# EasyEDA Pro project ProPrj_通用工程PCB-Update-V3.1_2025-07-16.epro, schematic [SCH]Advance_Board

## Sheets
1 P1: Board Name: Advance_Board; Create Date: 2025-07-09; Page Name: P1; Project Name: 通用工程PCB-Update-V3.1; Schematic Name: [SCH]Advance_Board; Update Date: 2025-07-09; Company: 嘉立创EDA; Page Size: A3; Version: V1.0
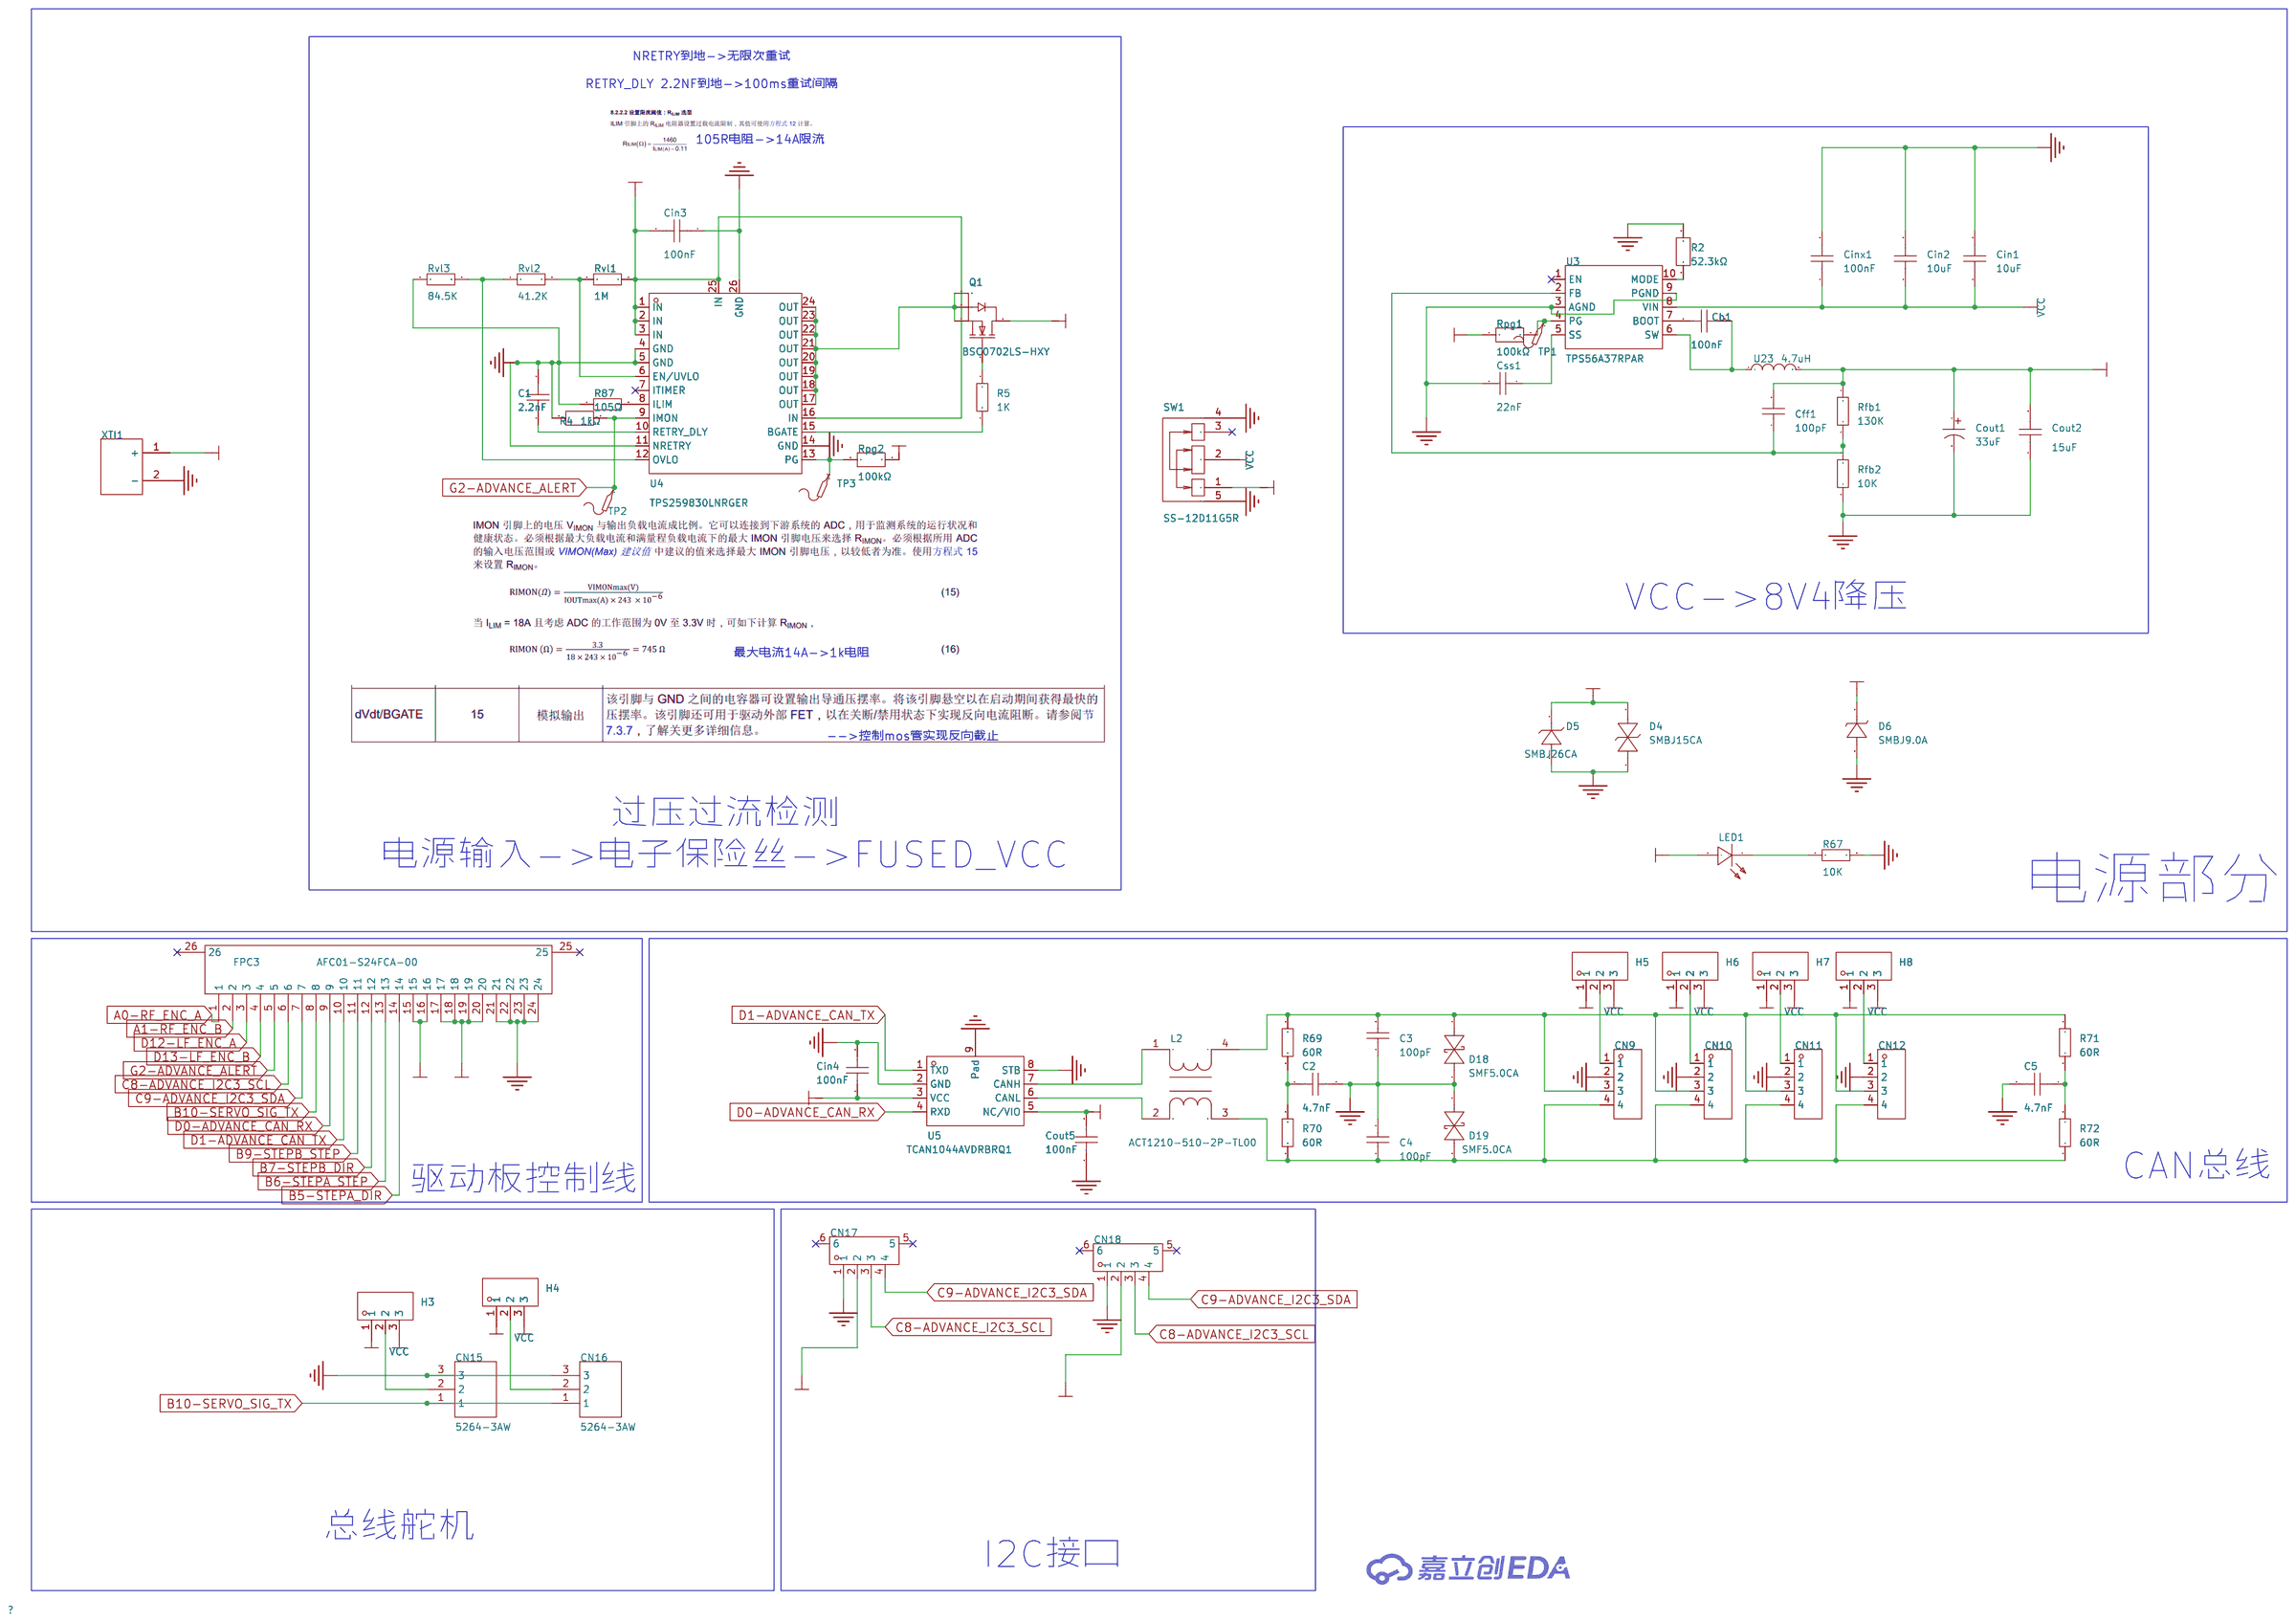
[diagram p2: P1]
2 P2: Page Name: P2
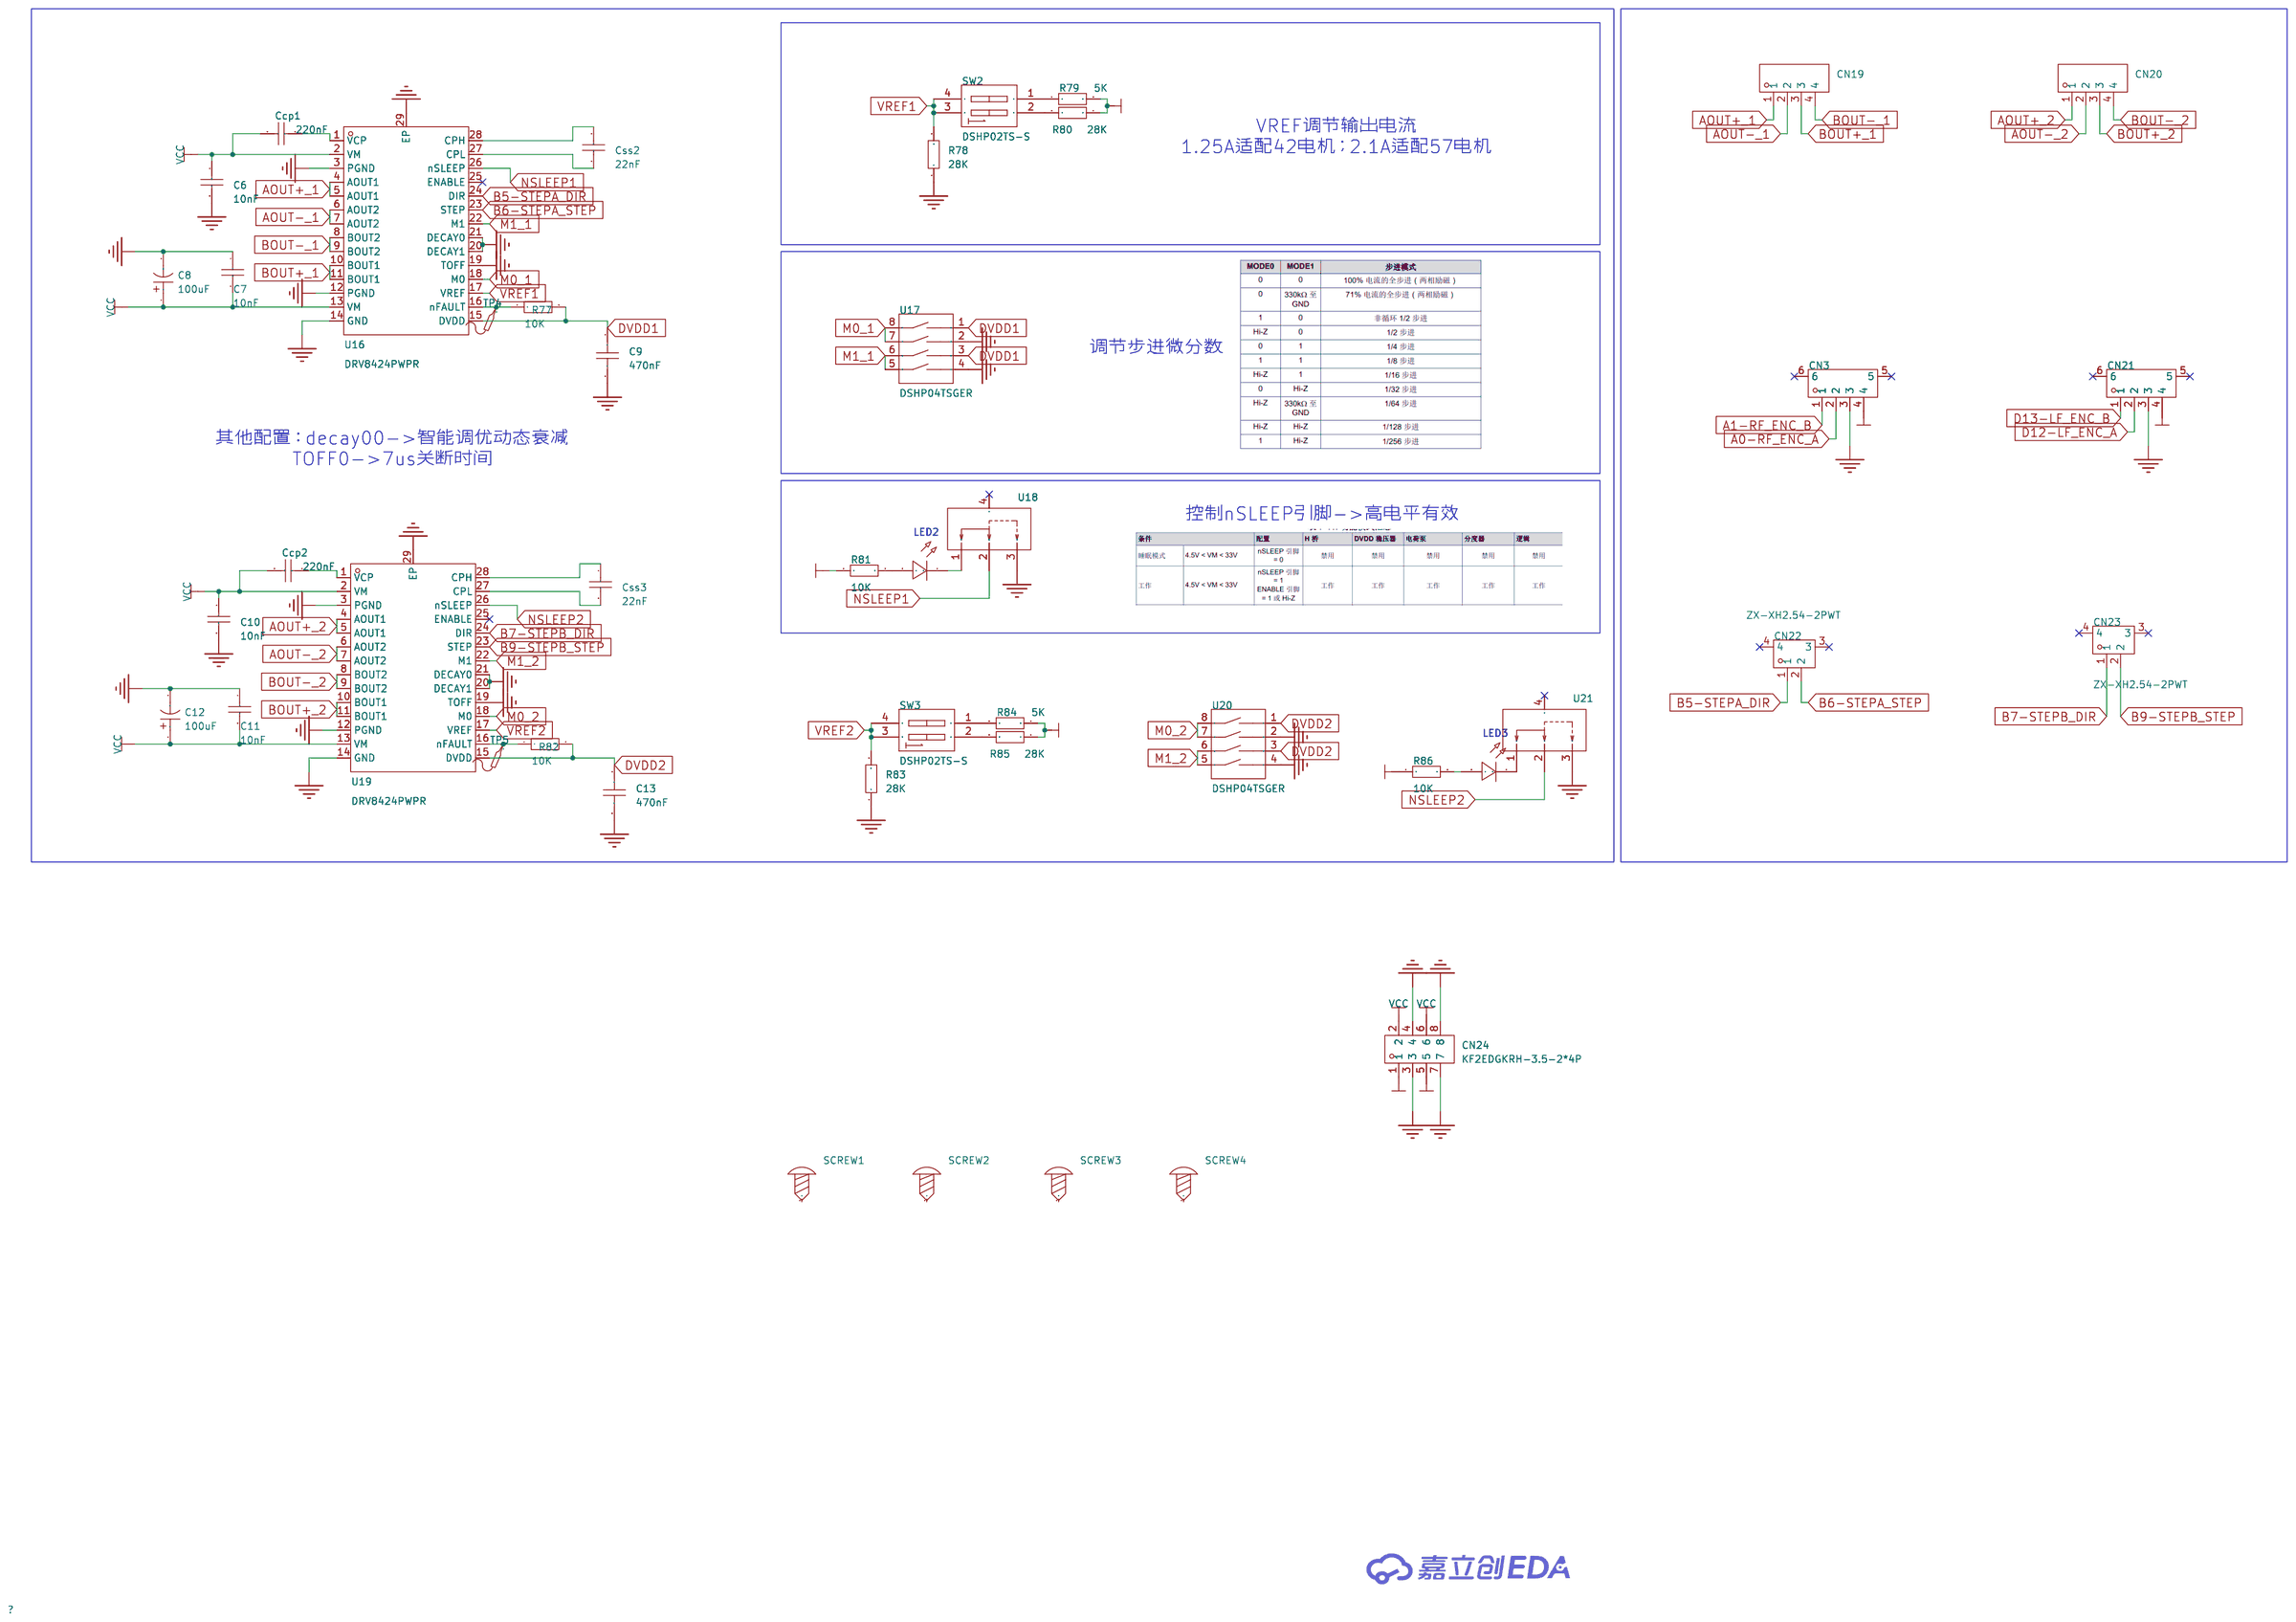
[diagram p3: P2]

## Parts
sheet P1
C1  2.2nF  [C0402]
C2  4.7nF  [C0402]
C3  100pF  [C0402]
C4  100pF  [C0402]
C5  4.7nF  [C0402]
Cb1  100nF  [C0603]
Cff1  100pF  [C0603]
Cin1  10uF  [C1210]
Cin2  10uF  [C1210]
Cin3  100nF  [C0603]
Cin4  100nF  [C0603]
Cinx1  100nF  [C0805]
CN9  KF2EDGR-3.5-4P  [CONN-TH_4P-P3.50_KF2EDGR-3.5-4P]
CN10  KF2EDGR-3.5-4P  [CONN-TH_4P-P3.50_KF2EDGR-3.5-4P]
CN11  KF2EDGR-3.5-4P  [CONN-TH_4P-P3.50_KF2EDGR-3.5-4P]
CN12  KF2EDGR-3.5-4P  [CONN-TH_4P-P3.50_KF2EDGR-3.5-4P]
CN15  5264-3AW  [CONN-TH_5264-3AW]
CN16  5264-3AW  [CONN-TH_5264-3AW]
CN17  XDWF-2500-04P  [CONN-SMD_4P-P2.54_MXXH-2.54-04P-WT1-0-A]
CN18  XDWF-2500-04P  [CONN-SMD_4P-P2.54_MXXH-2.54-04P-WT1-0-A]
Cout1  33uF  [CAP-SMD_BD5.0-L5.3-W5.3-LS6.3-FD]
Cout2  15uF  [C1812]
Cout5  100nF  [C0603]
Css1  22nF  [C0402]
D4  SMBJ15CA  [SMB_L4.6-W3.6-LS5.4-BI]
D5  SMBJ26CA  [SMB_L4.6-W3.6-LS5.4-RD]
D6  SMBJ9.0A  [SMB_L4.6-W3.6-LS5.3-RD]
D18  SMF5.0CA  [SOD-123FL_L2.7-W1.8-LS3.8-BI]
D19  SMF5.0CA  [SOD-123FL_L2.7-W1.8-LS3.8-BI]
FPC3  AFC01-S24FCA-00  [FPC-SMD_24P-P0.50_AFC01-S24FCA-00]
H3  -  [HDR-TH_3P-P2.54-V-M]
H4  -  [HDR-TH_3P-P2.54-V-M]
H5  -  [HDR-TH_3P-P2.54-V-M]
H6  -  [HDR-TH_3P-P2.54-V-M]
H7  -  [HDR-TH_3P-P2.54-V-M]
H8  -  [HDR-TH_3P-P2.54-V-M]
L2  ACT1210-510-2P-TL00  [FILTER-SMD_4P-L3.2-W2.5-BL_ACT1210]
LED1  LTST-C191KSKT  [LED0603-RD-YELLOW]
Q1  BSC0702LS-HXY  [TDSON-8_L5.9-W5.2-P1.27-BL]
R2  52.3kΩ  [R0402]
R4  1kΩ  [R0402]
R5  1K  [R0402]
R67  10K  [R0603]
R69  60R  [R0603]
R70  60R  [R0603]
R71  60R  [R0603]
R72  60R  [R0603]
R87  105Ω  [R0402]
Rfb1  130K  [R0805]
Rfb2  10K  [R0805]
Rpg1  100kΩ  [R0402]
Rpg2  100kΩ  [R0402]
Rvl1  1M  [R0805]
Rvl2  41.2K  [R0805]
Rvl3  84.5K  [R0805]
SW1  SS-12D11G5R  [SW-TH_SS-12D11G5R]
TP1  -  [Test-Point-0.5mm]
TP2  -  [Test-Point-0.5mm]
TP3  -  [Test-Point-0.5mm]
U3  TPS56A37RPAR  [VQFN-HR-10_L3.0-W3.0_TI_RPA]
U4  TPS259830LNRGER  [VQFN-24_L4.0-W4.0-P0.50-TL-EP_TI_RGE]
U5  TCAN1044AVDRBRQ1  [TDFN-8_L3.0-W3.0-P0.65-BL-EP]
U23  4.7uH  [IND-SMD_L7.0-W6.6_APH0630]
XTI1  -  [XT60PW]
sheet P2
C6  10nF  [C0402]
C7  10nF  [C0402]
C8  100uF  [CAP-SMD_BD6.3-L6.6-W6.6-FD-1]
C9  470nF  [C0402]
C10  10nF  [C0402]
C11  10nF  [C0402]
C12  100uF  [CAP-SMD_BD6.3-L6.6-W6.6-FD-1]
C13  470nF  [C0402]
Ccp1  220nF  [C0402]
Ccp2  220nF  [C0402]
CN3  XDWF-2500-04P  [CONN-SMD_4P-P2.54_MXXH-2.54-04P-WT1-0-A]
CN19  KF2EDGR-3.5-4P  [CONN-TH_4P-P3.50_KF2EDGR-3.5-4P]
CN20  KF2EDGR-3.5-4P  [CONN-TH_4P-P3.50_KF2EDGR-3.5-4P]
CN21  XDWF-2500-04P  [CONN-SMD_4P-P2.54_MXXH-2.54-04P-WT1-0-A]
CN22  ZX-XH2.54-2PWT  [CONN-SMD_2P-P2.54_MEGASTAR_ZX-XH2.54-2PWT]
CN23  ZX-XH2.54-2PWT  [CONN-SMD_2P-P2.54_MEGASTAR_ZX-XH2.54-2PWT]
CN24  KF2EDGKRH-3.5-2*4P  [CONN-TH_8P-P3.50_KEFA_KF2EDGKRH-3.5-2-4P]
Css2  22nF  [C0402]
Css3  22nF  [C0402]
LED2  -  [LED_0402]
LED3  -  [LED_0402]
R77  10K  [R0402]
R78  28K  [R0402]
R79  5K  [R0402]
R80  28K  [R0402]
R81  10K  [R0402]
R82  10K  [R0402]
R83  28K  [R0402]
R84  5K  [R0402]
R85  28K  [R0402]
R86  10K  [R0402]
SCREW1  -  [M3螺丝]
SCREW2  -  [M3螺丝]
SCREW3  -  [M3螺丝]
SCREW4  -  [M3螺丝]
SW2  DSHP02TS-S  [SW-SMD_DSHP02TS-S]
SW3  DSHP02TS-S  [SW-SMD_DSHP02TS-S]
TP4  -  [Test-Point-0.5mm]
TP5  -  [Test-Point-0.5mm]
U16  DRV8424PWPR  [HTSSOP-28_L9.7-W4.4-P0.65-LS6.4-BL-EP3.8]
U17  DSHP04TSGER  [SW-SMD_8P-L6.7-W5.4-P1.27-LS8.4]
U18  MSS12C02LS-BB2.0  [SW-SMD_MSS12C02LS-HB2.0-1]
U19  DRV8424PWPR  [HTSSOP-28_L9.7-W4.4-P0.65-LS6.4-BL-EP3.8]
U20  DSHP04TSGER  [SW-SMD_8P-L6.7-W5.4-P1.27-LS8.4]
U21  MSS12C02LS-BB2.0  [SW-SMD_MSS12C02LS-HB2.0-1]

## Library data of the parts
C1 = CC0402JRX7R9BB222: 容值:2.2nF;精度:±5%;额定电压:50V;材质(温度系数):X7R;; LCSC Part Name: 2.2nF ±5% 50V; Supplier Part: C513667; Manufacturer: YAGEO(国巨); Supplier Footprint: 0402; JLCPCB Part Class: 扩展库; Datasheet: https://atta.szlcsc.com/upload/public/pdf/source/20200415/C513667_43ACA5E3BCCDD816EC65E9B61132137F.pdf; Supplier: LCSC; Tolerance: ±5%; Voltage Rated: 50V; Temperature Coefficient: X7R
C2 C5 = GRM1555C1H472JE01D: 容值:4.7nF;精度:±5%;额定电压:50V;材质(温度系数):C0G;; LCSC Part Name: 4.7nF ±5% 50V; Supplier Part: C1518204; Manufacturer: muRata(村田); Supplier Footprint: 0402; JLCPCB Part Class: 扩展库; Datasheet: https://atta.szlcsc.com/upload/public/pdf/source/20211103/8141A083312BB8EB0F68297C590CBCF9.pdf; Supplier: LCSC; Tolerance: ±5%; Voltage Rated: 50V; Temperature Coefficient: C0G
C3 C4 = 0402CG101J500NT: 容值:100pF;精度:±5%;额定电压:50V;材质(温度系数):C0G;; LCSC Part Name: 100pF ±5% 50V; Supplier Part: C1546; Manufacturer: FH(风华); Supplier Footprint: 0402; JLCPCB Part Class: 基础库; Datasheet: https://atta.szlcsc.com/upload/public/pdf/source/20200305/C486355_26A10D38EF8C2A5C37091D0039909270.pdf; Supplier: LCSC; Tolerance: ±5%; Voltage Rated: 50V; Temperature Coefficient: C0G
Cb1 = CAP_0603: Supplier Footprint: 0603
Cff1 = CL10C101JB8NNNC: 容值:100pF;精度:±5%;额定电压:50V;材质(温度系数):C0G;; LCSC Part Name: 100pF ±5% 50V; Supplier Part: C14858; Manufacturer: SAMSUNG(三星); Supplier Footprint: 0603; JLCPCB Part Class: 基础库; Datasheet: https://atta.szlcsc.com/upload/public/pdf/source/20160218/1457707763339.pdf; Supplier: LCSC; Tolerance: ±5%; Voltage Rated: 50V; Temperature Coefficient: C0G
Cin1 Cin2 = GRM32EC72A106KE05L: 容值:10uF;精度:±10%;额定电压:100V;温度系数:X7S;; LCSC Part Name: 10uF ±10% 100V; Supplier Part: C576517; Manufacturer: muRata(村田); Supplier Footprint: 1210; Datasheet: https://atta.szlcsc.com/upload/public/pdf/source/20200716/C162505_CE68ED646330179BB59D1BEC6A5D09D7.pdf; Supplier: LCSC; Tolerance: ±10%; Voltage Rating: 100V; Temperature Coefficient: X7S
Cin3 Cin4 Cout5 = CL10B104KB8NNNC: 容值:100nF;精度:±10%;额定电压:50V;材质(温度系数):X7R;; LCSC Part Name: 100nF ±10% 50V; Supplier Part: C1591; Manufacturer: SAMSUNG(三星); Supplier Footprint: 0603; JLCPCB Part Class: 扩展库; Datasheet: https://atta.szlcsc.com/upload/public/pdf/source/20160218/1457707763339.pdf; Supplier: LCSC; Tolerance: ±10%; Voltage Rated: 50V; Temperature Coefficient: X7R
Cinx1 = CC0805KRX7R9BB104: 容值:100nF;精度:±10%;额定电压:50V;材质(温度系数):X7R;; LCSC Part Name: 100nF ±10% 50V; Supplier Part: C49678; Manufacturer: YAGEO(国巨); Supplier Footprint: 0805; JLCPCB Part Class: 基础库; Datasheet: https://atta.szlcsc.com/upload/public/pdf/source/20180224/C181747_15194369449651363981.pdf; Supplier: LCSC; Tolerance: ±10%; Voltage Rated: 50V; Temperature Coefficient: X7R
CN9-CN12 CN19 CN20 = KF2EDGR-3.5-4P: 连接器类型:板端/插座-闭口;固定方式:-;结构:1x4P;间距:3.5mm;颜色:绿色;安装方式:弯针;排数:1;每排PIN数:4;额定电流:10A;额定电压:300V;线规 - AWG:-;线规 - 平方毫米:-;触头材质:铜合金;触头镀层:锡;工作温度范围:-40℃~+105℃;焊接温度(最大值):-;; LCSC Part Name: 1x4P 3.5mm 排数:1 每排P数:4; Supplier Part: C441173; Manufacturer: KEFA(科发); Supplier Footprint: 弯插,P=3.5mm; JLCPCB Part Class: 扩展库; Datasheet: https://atta.szlcsc.com/upload/public/pdf/source/20230331/72E4E5AAB7D73656319D871C62219080.pdf; Supplier: LCSC; Connector Type: 板端/插座-闭口; Structure: 1x4P; Pitch: 3.5mm; Color: 绿色; Mounting Style: 弯针; Number of Pins: 4P; Number of Rows: 1; Number of PINs Per Row: 4; Current Rating (Max): 10A; Voltage Rating (Max): 300V; Contact Material: 铜合金; Contact Plating: 锡; Operating Temperature Range: -40℃~+105℃
CN15 CN16 = 5264-3AW: 插针结构:1x3P;间距:2.5mm;安装方式:弯插;参考系列:Mini-SPOX(5264);总PIN数:3P;排数:1;每排PIN数:3;行距:-;额定电流:-;触头材质:-;触头镀层:-;工作温度:-;; LCSC Part Name: 1x3P 间距:2.5mm 弯插 系列:Mini-SPOX(5264); Supplier Part: C48374; Manufacturer: BOOMELE(博穆精密); Supplier Footprint: 弯插,P=2.5mm; JLCPCB Part Class: 扩展库; Datasheet: https://atta.szlcsc.com/upload/public/pdf/source/20180125/C176652_15168701824541304803.pdf; Supplier: LCSC; Pins Structure: 1x3P; Pitch: 2.5mm; Mounting Type: 弯插; Reference Series: Mini-SPOX(5264); Number of Pins: 3P; Number of Rows: 1; Number of PINs Per Row: 3
CN3 CN17 CN18 CN21 = XDWF-2500-04P: 间距:2.54mm;安装方式:卧贴;参考系列:XH;总PIN数:4P;额定电流:4A;工作温度范围:-40℃~+85℃;; LCSC Part Name: 间距:2.54mm 卧贴 系列:XH; Supplier Part: C19723931; Manufacturer: LX(连欣科技); Supplier Footprint: SMD,P=2.5mm,卧贴; JLCPCB Part Class: 扩展库; Datasheet: https://atta.szlcsc.com/upload/public/pdf/source/20231222/6CB0E40CA6FFE63C5D87C69622E580AB.pdf; Supplier: LCSC; Pitch: 2.54mm; Mounting Style: 卧贴; Reference Series: XH; Number of Pins: 4P; Current Rating (Max): 4A; Operating Temperature Range: -40℃~+85℃
Cout1 = RVT1E330M0505_C72507: 容值:33uF;精度:±20%;额定电压:25V;纹波电流:30mA@120Hz;等效串联电阻(ESR):-;; LCSC Part Name: 33uF ±20% 25V; Supplier Part: C72507; Manufacturer: ROQANG(容强); Manufacturer Part: RVT1E330M0505; Supplier Footprint: SMD,D5xL5.4mm; JLCPCB Part Class: 扩展库; Datasheet: https://atta.szlcsc.com/upload/public/pdf/source/20170325/1490427950282.pdf; Supplier: LCSC; Tolerance: ±20%; Voltage Rating: 25V; Ripple Current: 30mA@120Hz; Diameter: 5mm; Height - Seated (Max): 5.4mm; Lifetime: 2000hrs@105℃; Operating Temperature: -40℃~+105℃
Cout2 = C4532X7R1E156MT000N: 容值:15uF;精度:±20%;额定电压:25V;温度系数:X7R;; LCSC Part Name: 15uF ±20% 25V; Supplier Part: C342618; Manufacturer: TDK; Supplier Footprint: 1812; JLCPCB Part Class: 扩展库; Datasheet: https://atta.szlcsc.com/upload/public/pdf/source/20190612/C361180_85CC9FB0751BEA97238DE56AB4AF0B1F.pdf; Supplier: LCSC; Tolerance: ±20%; Voltage Rating: 25V; Temperature Coefficient: X7R
Ccp1 Ccp2 Css1-Css3 = GRM155R71H223KA12D: 容值:22nF;精度:±10%;额定电压:50V;材质(温度系数):X7R;; LCSC Part Name: 22nF ±10% 50V; Supplier Part: C77023; Manufacturer: muRata(村田); Supplier Footprint: 0402; JLCPCB Part Class: 扩展库; Datasheet: https://atta.szlcsc.com/upload/public/pdf/source/20180326/C77023_485AB0D0559A254D360F85D8E7719291.pdf; Supplier: LCSC; Tolerance: ±10%; Voltage Rated: 50V; Temperature Coefficient: X7R
D4 = SMBJ15CA_C19077570: 极性:双向;反向截止电压(Vrwm):15V;钳位电压:24.4V;峰值脉冲电流(Ipp):24.59A;峰值脉冲功率(Ppp):600W;击穿电压:18.5V;; Supplier Part: C19077570; Manufacturer: 宏嘉诚; Supplier Footprint: SMB; JLCPCB Part Class: 扩展库; Datasheet: https://atta.szlcsc.com/upload/public/pdf/source/20250107/474F05451FC8AB27D7FA0238914F96F6.pdf; Supplier: LCSC; Polarity: 双向; Reverse Stand-Off Voltage (Vrwm): 15V; Clamping Voltage: 24.4V; Peak Pulse Current (Ipp): 24.59A; Peak Pulse Power Dissipation (Ppp): 600W; Voltage - Breakdown: 18.5V; Reverse Leakage Current (Ir): 5uA; Type: TVS
D5 = SMBJ26CA_C19077581: 极性:双向;反向截止电压(Vrwm):26V;钳位电压:42.1V;峰值脉冲电流(Ipp):14.25A;峰值脉冲功率(Ppp):600W;击穿电压:28.9V;; Supplier Part: C19077581; Manufacturer: 宏嘉诚; Supplier Footprint: SMB; Datasheet: https://atta.szlcsc.com/upload/public/pdf/source/20250107/474F05451FC8AB27D7FA0238914F96F6.pdf; Supplier: LCSC; Polarity: 双向; Reverse Stand-Off Voltage (Vrwm): 26V; Clamping Voltage: 42.1V; Peak Pulse Current (Ipp): 14.25A; Peak Pulse Power Dissipation (Ppp): 600W; Voltage - Breakdown: 28.9V; Reverse Leakage Current (Ir): 5uA; Number of Channels: 单路; Type: TVS
D6 = SMBJ9.0A_C707989: 极性:单向;反向截止电压(Vrwm):9V;最大钳位电压:15.4V;峰值脉冲电流(Ipp)@10/1000us:39A;击穿电压:10V;; Supplier Part: C707989; Manufacturer: FTR(乔光电子); Supplier Footprint: SMB(DO-214AA); JLCPCB Part Class: 扩展库; Datasheet: https://atta.szlcsc.com/upload/public/pdf/source/20200720/C707464_FB97EBFFE172F4695B7A4D07E0D32658.pdf; Supplier: LCSC; polarity: 单向; Reverse Stand-Off Voltage (Vrwm): 9V; Maximum Clamping Voltage: 15.4V; Peak Pulse Current (Ipp)@10/1000us: 39A; Breakdown Voltage: 10V; Type: TVS
D18 D19 = SMF5.0CA_C19077498: 极性:双向;反向截止电压(Vrwm):5V;最大钳位电压:9.2V;峰值脉冲电流(Ipp):21.7A;峰值脉冲功率(Ppp):200W;击穿电压:6.4V;; Supplier Part: C19077498; Manufacturer: 宏迦橙; Supplier Footprint: SOD-123FL; JLCPCB Part Class: 扩展库; Datasheet: https://atta.szlcsc.com/upload/public/pdf/source/20241029/BBF9A11676F655A5C9D4546A153AB943.pdf; Supplier: LCSC; polarity: 双向; Reverse Stand-Off Voltage (Vrwm): 5V; Maximum Clamping Voltage: 9.2V; Peak Pulse Current (Ipp): 21.7A; Peak Pulse Power Dissipation (Ppp): 200W; Breakdown Voltage: 6.4V; Reverse Leakage Current (Ir): 400uA; Number of Lines: 单路; Operating Temperature: -55℃~+155℃; Type: TVS
FPC3 = AFC01-S24FCA-00: 锁定特性:翻盖式;触点类型:下接;触点数量:24P;间距:0.5mm;安装类型:卧贴;; LCSC Part Name: 间距:0.5mm P数:24P 翻盖式 下接; Supplier Part: C262669; Manufacturer: JS(钜硕电子); Supplier Footprint: SMD,P=0.5mm,卧贴; JLCPCB Part Class: 扩展库; Datasheet: https://atta.szlcsc.com/upload/public/pdf/source/20190816/C413942_2A72D1AC756EAE17EEDF756A339D4500.pdf; Supplier: LCSC; Locking Feature: 翻盖式; Contact Type: 下接; Number of Contacts: 24P; Pitch: 0.5mm; Mounting Type: 卧贴; FFC, FCB Thickness: 0.3mm; Height Above Board: 2mm
H3-H8 = HDR-M_2.54_1x3P: Supplier Part: C2937625; Supplier Footprint: 插件
L2 = ACT1210-510-2P-TL00: 线路数:2;电感 @ 频率:51uH@100kHz;阻抗 @ 频率:2.6kΩ@10MHz;直流电阻(DCR):700mΩ;; LCSC Part Name: 两路 共模滤波器 阻抗2.6kΩ@10MHz; Supplier Part: C95572; Manufacturer: TDK; Supplier Footprint: 3.2x2.5mm; JLCPCB Part Class: 扩展库; Datasheet: https://atta.szlcsc.com/upload/public/pdf/source/20171113/C95572_15105616815011116176.pdf; Supplier: LCSC; Number of Lines: 2; Current Rating: 200mA; Inductance @ Frequency: 51uH@100kHz; Voltage Rating - DC: 80V; Impedance @ Frequency: 2.6kΩ@10MHz; DC Resistance (DCR): 700mΩ; Operating Temperature: -55℃~+150℃
LED1 = LTST-C191KSKT: 发光颜色:黄色;正向电压(VF):2.1V;功率:75mW;正向电流:20mA;主波长:584.5nm~597nm;二极管配置:-;透镜颜色:无色透明透镜;色温:-;发光强度:104mcd;发光角度:130°;载带方式:-;工作温度:-55℃~+85℃;; LCSC Part Name: 黄灯; Supplier Part: C125100; Manufacturer: LITEON(光宝); Supplier Footprint: 0603; JLCPCB Part Class: 扩展库; Datasheet: https://atta.szlcsc.com/upload/public/pdf/source/20180129/C125100_15171877314981315871.pdf; Supplier: LCSC; Emitted Color: 黄色; Forward Voltage (VF): 2.1V; Power Dissipation: 75mW; Forward Current: 20mA; Dominant Wavelength: 584.5nm~597nm; Peak Wavelength: 588nm; Lens Color: 无色透明透镜; Luminous Intensity: 104mcd; Viewing Angle: 130°; Operating Temperature: -55℃~+85℃
Q1 = BSC0702LS-HXY: 类型:1个N沟道;漏源电压(Vdss):60V;连续漏极电流(Id):125A;导通电阻(RDS(on)@Vgs,Id):2.4mΩ@10V,20A;功率:113W;阈值电压(Vgs(th)@Id):2.2V@250uA;; LCSC Part Name: 1个N沟道 耐压:60V 电流:125A; Supplier Part: C20606289; Manufacturer: HXY MOSFET(华轩阳电子); Supplier Footprint: DFN-8L(5x6); JLCPCB Part Class: 扩展库; Datasheet: https://atta.szlcsc.com/upload/public/pdf/source/20240123/076D22E6000EDC20B3B44975BEF7E0EA.pdf; Supplier: LCSC; Type: 1个N沟道; Drain Source Voltage (Vdss): 60V; Continuous Drain Current (Id): 125A; Drain Source On Resistance (RDS(on)@Vgs,Id): 2.4mΩ@10V,20A; Power Dissipation (Pd): 113W; Gate Threshold Voltage (Vgs(th)@Id): 2.2V@250uA
R2 = FRC0402F5232TS: 电阻类型:厚膜电阻;阻值:52.3kΩ;精度:±1%;功率:62.5mW;工作电压:50V;温度系数:±100ppm/℃;; LCSC Part Name: 52.3kΩ ±1% 62.5mW 厚膜电阻; Supplier Part: C2998086; Manufacturer: FOJAN(富捷); Supplier Footprint: 0402; JLCPCB Part Class: 扩展库; Datasheet: https://atta.szlcsc.com/upload/public/pdf/source/20211221/925EC7D7225764EE0046F22065062C87.pdf; Supplier: LCSC; Type: 厚膜电阻; Tolerance: ±1%; Power(Watts): 62.5mW; Voltage-Supply(Max): 50V; Temperature Coefficient: ±100ppm/℃; Operating Temperature: -55℃~+155℃
R4 = RT0402BRD071KL: 电阻类型:薄膜电阻;阻值:1kΩ;精度:±0.1%;功率:62.5mW;最大工作电压:50V;温度系数:±25ppm/℃;; LCSC Part Name: 薄膜电阻 1kΩ ±0.1% 62.5mW; Supplier Part: C852624; Manufacturer: YAGEO(国巨); Supplier Footprint: 0402; JLCPCB Part Class: 扩展库; Datasheet: https://atta.szlcsc.com/upload/public/pdf/source/20210609/C852624_9EB141A274604F87C6BB037C8019D50A.pdf; Supplier: LCSC; Type: 薄膜电阻; Tolerance: ±0.1%; Power(Watts): 62.5mW; Overload Voltage (Max): 50V; Temperature Coefficient: ±25ppm/℃; Operating Temperature Range: -55℃~+155℃
R5 = Res_0201: Supplier Footprint: 0201
R67 R69-R72 = Res_0603: Supplier Footprint: 0603
R87 = 0402WGF1050TCE: 电阻类型:厚膜电阻;阻值:105Ω;精度:±1%;功率:62.5mW;最大工作电压:50V;温度系数:±100ppm/℃;; LCSC Part Name: 105Ω ±1% 62.5mW 厚膜电阻; Supplier Part: C75737; Manufacturer: UNI-ROYAL(厚声); Supplier Footprint: 0402; JLCPCB Part Class: 扩展库; Datasheet: https://atta.szlcsc.com/upload/public/pdf/source/20200306/C422600_1E6D84923E4A46A82E41ADD87F860B5C.pdf; Supplier: LCSC; Type: 厚膜电阻; Tolerance: ±1%; Power(Watts): 62.5mW; Overload Voltage (Max): 50V; Temperature Coefficient: ±100ppm/℃; Operating Temperature Range: -55℃~+155℃
Rfb1 Rfb2 Rvl1-Rvl3 = Res_0805: Supplier Footprint: 0805
Rpg1 Rpg2 = FRC0402F1003TS: 电阻类型:厚膜电阻;阻值:100kΩ;精度:±1%;功率:62.5mW;最大工作电压:50V;温度系数:±100ppm/℃;; LCSC Part Name: 100kΩ ±1% 62.5mW 厚膜电阻; Supplier Part: C2906859; Manufacturer: FOJAN(富捷); Supplier Footprint: 0402; JLCPCB Part Class: 扩展库; Datasheet: https://atta.szlcsc.com/upload/public/pdf/source/20211221/925EC7D7225764EE0046F22065062C87.pdf; Supplier: LCSC; Type: 厚膜电阻; Tolerance: ±1%; Power(Watts): 62.5mW; Overload Voltage (Max): 50V; Temperature Coefficient: ±100ppm/℃; Operating Temperature Range: -55℃~+155℃
SW1 = SS-12D11G5R: 电路结构:单刀双掷;安装方式:弯插;开关颜色:黑色;额定电流(DC):5A;额定电压(DC):125V;额定电流(AC):5A;额定电压(AC):125V;机械寿命:1万次;; LCSC Part Name: 柄长5mm 弯插双档 滑动开关; Supplier Part: C388633; Manufacturer: XKB Connectivity(中国星坤); Supplier Footprint: 插件; JLCPCB Part Class: 扩展库; Datasheet: https://atta.szlcsc.com/upload/public/pdf/source/20211009/84F89DEF741E27E9E55DE4039DC07CAD.pdf; Supplier: LCSC; Circuit: 单刀双掷; Actuator Style: 矩形柱状; Pin Style: PC引脚; Switch Length: 13.5mm; Switch Width: 6.6mm; Switch Height: 6.3mm; Mounting Style: 弯插; Actuator Color: 黑色; Current Rating (DC): 5A; Voltage Rating (DC): 125V; Current Rating (AC): 5A; Voltage Rating (AC): 125V; Mechanical Life: 1万次; Operating Temperature: -40℃~+85℃
TP1-TP5 = Test-Point: Test Point 测试点
U3 = TPS56A37RPAR: 功能类型:-;输出类型:-;工作电压:4.5V~28V;输出电压:-;输出电流:10A;; Supplier Part: C22392669; Manufacturer: TI(德州仪器); Supplier Footprint: VQFN-HR-10(3x3); JLCPCB Part Class: 扩展库; Datasheet: https://www.ti.com.cn/cn/lit/ds/symlink/tps56a37.pdf?ts=1739433904040&ref_url=https%253A%252F%252Fwww.ti.com.cn%252Fsitesearch%252Fzh-cn%252Fdocs%252Funiversalsearch.tsp%253FlangPref%253Dzh-CN%2526nr%253D12%2526searchTerm%253DTPS56A37RPAR; Supplier: LCSC; Voltage - Supply: 4.5V~28V; Output Current: 10A; Frequency - Switching: 500kHz; Operating Temperature: -40℃~+150℃@(TJ); Number of Outputs: 1; Switch tube (built-in/external): 内置
U4 = TPS259830LNRGER: 额定电压:2.7V~26V;; Supplier Part: C20607218; Manufacturer: TI(德州仪器); Supplier Footprint: VQFN-24; JLCPCB Part Class: 扩展库; Supplier: LCSC; Voltage Rating: 2.7V~26V
U5 = TCAN1044AVDRBRQ1: 类型:CAN-FD收发器;数据速率:5Mbps;; LCSC Part Name: 具有待机模式和故障保护功能的TCAN1044A-Q1和TCAN1044AV-Q1汽车类CAN FD收发器; Supplier Part: C3234119; Manufacturer: TI(德州仪器); Supplier Footprint: SON-8(3x3); JLCPCB Part Class: 扩展库; Datasheet: https://www.ti.com/cn/lit/gpn/tcan1044a-q1; Supplier: LCSC; Type: CAN-FD收发器; Data Rate: 5Mbps; Supply Voltage: 4.5V~5.5V; Supply Current: 70mA; Operating Temperature: -40℃~+150℃
U23 = APH0630T4R7M: 电感值:4.7uH;精度:±20%;额定电流:5.15A;饱和电流(Isat):7.47A;类型:一体成型电感;; LCSC Part Name: 4.7uH ±20% 7.47A; Supplier Part: C5349705; Manufacturer: APV(爱普微); Supplier Footprint: SMD,7x6.6mm; JLCPCB Part Class: 扩展库; Datasheet: https://atta.szlcsc.com/upload/public/pdf/source/20240422/44C6AF90C0CE08E50D7C2708B16BB974.pdf; Supplier: LCSC; Tolerance: ±20%; Rated Current: 5.15A; Saturation Current (Isat): 7.47A; DC Resistance (DCR): 33mΩ; Type: 一体成型电感
XTI1 = XT60PW-M
C6 C7 C10 C11 = CL05B103KB5NNNC: 容值:10nF;精度:±10%;额定电压:50V;材质(温度系数):X7R;; LCSC Part Name: 10nF ±10% 50V; Supplier Part: C15195; Manufacturer: SAMSUNG(三星); Supplier Footprint: 0402; JLCPCB Part Class: 基础库; Datasheet: https://atta.szlcsc.com/upload/public/pdf/source/20160218/1457707763339.pdf; Supplier: LCSC; Tolerance: ±10%; Voltage Rated: 50V; Temperature Coefficient: X7R
C8 C12 = JVJ25V100M6x5: 容值:100uF;精度:±20%;额定电压:25V;纹波电流:72mA@120Hz;; LCSC Part Name: 100uF ±20% 25V; Supplier Part: C46550402; Manufacturer: 捷而瑞; Supplier Footprint: SMD,D6.3xL5.4mm; JLCPCB Part Class: 扩展库; Datasheet: https://atta.szlcsc.com/upload/public/pdf/source/20250526/372E583B5965CEB57A276EA554306514.pdf; Supplier: LCSC; Tolerance: ±20%; Voltage Rating: 25V; Ripple Current: 72mA@120Hz; Diameter: 6.3mm; Height - Seated (Max): 5.4mm; Operating Temperature: -55℃~+105℃
C9 C13 = GRM155R61H474KE11D: 容值:470nF;精度:±10%;额定电压:50V;材质(温度系数):X5R;; LCSC Part Name: 470nF ±10% 50V; Supplier Part: C437527; Manufacturer: muRata(村田); Supplier Footprint: 0402; JLCPCB Part Class: 扩展库; Datasheet: https://atta.szlcsc.com/upload/public/pdf/source/20191226/C475964_3FAF76C90CD8FFB09F50C7480ADA926F.pdf; Supplier: LCSC; Tolerance: ±10%; Voltage Rated: 50V; Temperature Coefficient: X5R
CN22 CN23 = ZX-XH2.54-2PWT: 插针结构:1x2P;间距:2.5mm;安装方式:卧贴;参考系列:XH;总PIN数:2P;排数:1;每排PIN数:2;行距:-;额定电流:-;触头材质:黄铜;触头镀层:锡;工作温度范围:-;; LCSC Part Name: 1x2P 间距:2.5mm 卧贴 系列:XH; Supplier Part: C7429671; Manufacturer: Megastar(兆星); Supplier Footprint: SMD,P=2.5mm,卧贴; JLCPCB Part Class: 扩展库; Datasheet: https://atta.szlcsc.com/upload/public/pdf/source/20230619/D2020A0565D707024C90AEAD14B7AF42.pdf; Supplier: LCSC; Pins Structure: 1x2P; Pitch: 2.5mm; Mounting Type: 卧贴; Reference Series: XH; Number of Pins: 2P; Number of Rows: 1; Number of PINs Per Row: 2; Contact Material: 黄铜; Contact Plating: 锡; Supplementary Features: 辅助焊脚; Color: 米色; Z-Height of the Board: 6.2mm; X-Length of Bottom Edge on Board (Spacing Line): 10mm; Y-Width of Bottom Edge on Board: 10.5mm
CN24 = KF2EDGKRH-3.5-2*4P: 连接器类型:板端/插座-闭口;固定方式:-;结构:2x4P;间距:3.5mm;颜色:绿色;安装方式:弯针;排数:2;每排PIN数:4;额定电流:10A;额定电压:300V;线规 - AWG:-;线规 - 平方毫米:-;触头材质:铜合金;触头镀层:锡;工作温度范围:-40℃~+105℃;焊接温度(最大值):-;; LCSC Part Name: 2x4P 3.5mm 排数:2 每排P数:4; Supplier Part: C2923163; Manufacturer: KEFA(科发); Supplier Footprint: 弯插,P=3.5mm; JLCPCB Part Class: 扩展库; Datasheet: https://atta.szlcsc.com/upload/public/pdf/source/20230331/43FC3442599D3649A899007890783DD4.pdf; Supplier: LCSC; Connector Type: 板端/插座-闭口; Structure: 2x4P; Pitch: 3.5mm; Color: 绿色; Mounting Style: 弯针; Number of Pins: 8P; Number of Rows: 2; Number of PINs Per Row: 4; Current Rating (Max): 10A; Voltage Rating (Max): 300V; Contact Material: 铜合金; Contact Plating: 锡; Operating Temperature Range: -40℃~+105℃
LED2 LED3 = LED_0402-B: Supplier Footprint: 0402
R77-R86 = Res_0402: Supplier Footprint: 0402
SCREW1-SCREW4 = M3螺丝: Supplier Footprint: 插件
SW2 SW3 = DSHP02TS-S: 类型:平拨,凹槽式;电路结构:单刀单掷;开关位数:2位;额定电流:25mA;额定电压:24V;使用寿命:3千次;颜色:黑色;; LCSC Part Name: 间距1.27mm 平拨,凹槽式 2位拨码开关; Supplier Part: C319052; Manufacturer: XKB Connectivity(中国星坤); Supplier Footprint: SMD-4P,4.1x5.4mm; JLCPCB Part Class: 扩展库; Datasheet: https://atta.szlcsc.com/upload/public/pdf/source/20211009/11BE85C99D2C85B0991AF4F9D6EB8BDE.pdf; Supplier: LCSC; Type: 平拨,凹槽式; Circuit: 单刀单掷; Number of Positions: 2位; Pin Style: 鸥翼型; Lead Pitch: 1.27mm; Current Rating: 25mA; Voltage Rating: 24V; Operating Temperature: -20℃~+70℃; Operating Life: 3千次; Color: 黑色
U16 U19 = DRV8424PWPR: DRV8424 具有集成电流检测功能和 1/256 微步进的 35V、2.5A 双极步进驱动器; Supplier Part: C2864825; Manufacturer: TI(德州仪器); Supplier Footprint: HTSSOP-28-EP; JLCPCB Part Class: 扩展库; Datasheet: https://www.ti.com/cn/lit/gpn/drv8425; Supplier: LCSC
U17 U20 = DSHP04TSGER_C3293144: 电路结构:单刀单掷;开关位数:4位;额定电流:25mA;额定电压:24V;使用寿命:3千次;颜色:黑色;; LCSC Part Name: 4位 1.27mm间距贴片型 KE拨码开关; Supplier Part: C3293144; Manufacturer: 康深; Supplier Footprint: SMD-8P,5.4x6.6mm; JLCPCB Part Class: 扩展库; Datasheet: https://atta.szlcsc.com/upload/public/pdf/source/20220713/C53382FBC579242FFD9AC69EAEDF7542.pdf; Supplier: LCSC; Circuit: 单刀单掷; Number of Positions: 4位; Lead Pitch: 1.27mm; Current Rating: 25mA; Voltage Rating: 24V; Operating Temperature: -30℃~+85℃; Operating Life: 3千次; Color: 黑色
U18 U21 = MSS12C02LS-BB2.0: 电路结构:单刀双掷;安装方式:立贴;开关颜色:-;额定电流(DC):100mA;额定电压(DC):12V;额定电流(AC):-;额定电压(AC):-;机械寿命:1万次;; Supplier Part: C3008585; Manufacturer: SHOU HAN(首韩); Supplier Footprint: SMD; JLCPCB Part Class: 扩展库; Datasheet: https://atta.szlcsc.com/upload/public/pdf/source/20220429/8AEFBC67104491914BC5659DE1F359A3.pdf; Supplier: LCSC; Circuit: 单刀双掷; Pin Style: SMD接片; Switch Length: 6.65mm; Switch Width: 2.75mm; Switch Height: 1.4mm; Mounting Style: 立贴; Current Rating (DC): 100mA; Voltage Rating (DC): 12V; Mechanical Life: 1万次; Operating Temperature: -25℃~+70℃

## Nets
3V3: Cout5.2 FPC3.15 FPC3.16 R79.2 R80.1 R84.2 R85.1 Rpg2.2 U5.5(NC/VIO)
5V: Cin4.1 CN3.4 CN17.2 CN18.2 CN21.4 FPC3.17 FPC3.18 FPC3.19 FPC3.20 R81.1 R86.1 Rpg1.1 U5.3(VCC)
8V4: Cff1.2 CN24.1 CN24.5 Cout1.1 Cout2.2 D6.1(C) H3.1 H4.1 H5.1 H6.1 H7.1 H8.1 LED1.2(+) Rfb1.1 U23.2
DVDD1: C9.1 R77.2 U16.15(DVDD) U17.1 U17.3
DVDD2: C13.1 R82.2 U19.15(DVDD) U20.1 U20.3
GND: C1.2 C2.2 C3.1 C4.2 C5.2 C6.2 C7.1 C8.2 C9.2 C10.2 C11.1 C12.2 C13.2 Cin1.2 Cin2.2 Cin3.1 Cin4.2 Cinx1.2 CN3.3 CN9.2 CN10.2 CN11.2 CN12.2 CN15.3 CN16.3 CN17.1 CN18.1 CN21.3 CN24.3 CN24.4 CN24.7 CN24.8 Cout1.2 Cout2.1 Cout5.1 Css1.2 D4.1 D5.2(A) D6.2(A) D18.2(K) D19.1(A) FPC3.21 FPC3.22 FPC3.23 FPC3.24 R2.2 R4.1 R67.2 R78.1 R83.1 R87.1 Rfb2.1 Rvl3.1 SW1.4 SW1.5 U3.3(AGND) U3.9(PGND) U4.4(GND) U4.5(GND) U4.11(NRETRY) U4.14(GND) U4.26(GND) U5.2(GND) U5.8(STB) U5.9(Pad) U16.3(PGND) U16.12(PGND) U16.14(GND) U16.19(TOFF) U16.20(DECAY1) U16.21(DECAY0) U16.29(EP) U17.2 U17.4 U18.3 U19.3(PGND) U19.12(PGND) U19.14(GND) U19.19(TOFF) U19.20(DECAY1) U19.21(DECAY0) U19.29(EP) U20.2 U20.4 U21.3 XTI1.2(-)
VCC: C6.1 C7.2 C8.1 C10.1 C11.2 C12.1 Ccp1.2 Ccp2.2 Cin1.1 Cin2.1 Cinx1.1 CN24.2 CN24.6 H3.3 H4.3 H5.3 H6.3 H7.3 H8.3 SW1.2 U3.8(VIN) U16.2(VM) U16.13(VM) U19.2(VM) U19.13(VM)
A0-RF_ENC_A: CN3.2 FPC3.1
A1-RF_ENC_B: CN3.1 FPC3.2
AOUT+_1: CN19.1 U16.4(AOUT1) U16.5(AOUT1)
AOUT+_2: CN20.1 U19.4(AOUT1) U19.5(AOUT1)
AOUT-_1: CN19.2 U16.6(AOUT2) U16.7(AOUT2)
AOUT-_2: CN20.2 U19.6(AOUT2) U19.7(AOUT2)
B5-STEPA_DIR: CN22.1 FPC3.14 U16.24(DIR)
B6-STEPA_STEP: CN22.2 FPC3.13 U16.23(STEP)
B7-STEPB_DIR: CN23.1 FPC3.12 U19.24(DIR)
B9-STEPB_STEP: CN23.2 FPC3.11 U19.23(STEP)
B10-SERVO_SIG_TX: CN15.1 CN16.1 FPC3.8
BAT_VCC: Cin3.2 D4.2 D5.1(K) Rvl1.1 U4.1(IN) U4.2(IN) U4.3(IN) U4.16(IN) U4.25(IN) XTI1.1(+)
BOUT+_1: CN19.3 U16.10(BOUT1) U16.11(BOUT1)
BOUT+_2: CN20.3 U19.10(BOUT1) U19.11(BOUT1)
BOUT-_1: CN19.4 U16.8(BOUT2) U16.9(BOUT2)
BOUT-_2: CN20.4 U19.8(BOUT2) U19.9(BOUT2)
C8-ADVANCE_I2C3_SCL: CN17.3 CN18.3 FPC3.6
C9-ADVANCE_I2C3_SDA: CN17.4 CN18.4 FPC3.7
D0-ADVANCE_CAN_RX: FPC3.9 U5.4(RXD)
D1-ADVANCE_CAN_TX: FPC3.10 U5.1(TXD)
D12-LF_ENC_A: CN21.2 FPC3.3
D13-LF_ENC_B: CN21.1 FPC3.4
FUSED_VCC: Q1.5(D) SW1.1
G2-ADVANCE_ALERT: FPC3.5 R4.2 TP2.1 U4.9(IMON)
M0_1: U16.18(M0) U17.7 U17.8
M0_2: U19.18(M0) U20.7 U20.8
M1_1: U16.22(M1) U17.5 U17.6
M1_2: U19.22(M1) U20.5 U20.6
NSLEEP1: U16.26(nSLEEP) U18.2
NSLEEP2: U19.26(nSLEEP) U21.2
VREF1: R78.2 SW2.3 SW2.4 U16.17(VREF)
VREF2: R83.2 SW3.3 SW3.4 U19.17(VREF)
$1N2586: Rpg1.2 TP1.1 U3.4(PG)
$1N2757: Css1.1 U3.5(SS)
$1N2774: Cb1.2 U3.6(SW) U23.1
$1N3335: Cb1.1 U3.7(BOOT)
$1N3736: Cff1.1 Rfb1.2 Rfb2.2 U3.2(FB)
$1N3843: R2.1 U3.10(MODE)
$1N4403: Rvl1.2 Rvl2.2 U4.6(EN/UVLO)
$1N4455: Rvl2.1 Rvl3.2 U4.12(OVLO)
$1N4604: C1.1 U4.10(RETRY_DLY)
$1N5370: Q1.4(G) R5.2
$1N5399: R5.1 U4.15(BGATE)
$1N5506: Q1.1(S) Q1.2(S) Q1.3(S) U4.17(OUT) U4.18(OUT) U4.19(OUT) U4.20(OUT) U4.21(OUT) U4.22(OUT) U4.23(OUT) U4.24(OUT)
$1N6333: LED1.1(-) R67.1
$1N6888: C2.1 R69.1 R70.2
$1N7703: C5.1 R71.1 R72.2
$1N8396: CN15.2 H3.2
$1N8453: CN16.2 H4.2
$1N8892: CN9.1 H5.2
$1N8949: CN10.1 H6.2
$1N9008: CN11.1 H7.2
$1N9072: CN12.1 H8.2
$1N11133: Rpg2.1 TP3.1 U4.13(PG)
$1N15353: L2.1 U5.7(CANH)
$1N15372: C3.2 CN9.3 CN10.3 CN11.3 CN12.3 D18.1(A) L2.4 R69.2 R71.2
$1N15376: L2.2 U5.6(CANL)
$1N15395: C4.1 CN9.4 CN10.4 CN11.4 CN12.4 D19.2(K) L2.3 R70.1 R72.1
$1N21136: R87.2 U4.8(ILIM)
$2N537: Ccp1.1 U16.1(VCP)
$2N882: Css2.1 U16.28(CPH)
$2N887: Css2.2 U16.27(CPL)
$2N1421: R77.1 TP4.1 U16.16(nFAULT)
$2N1750: R79.1 SW2.1
$2N1806: R80.2 SW2.2
$2N2402: LED2.1(C) U18.1
$2N3185: Css3.2 U19.27(CPL)
$2N3192: Css3.1 U19.28(CPH)
$2N3198: R82.1 TP5.1 U19.16(nFAULT)
$2N3201: Ccp2.1 U19.1(VCP)
$2N3394: R85.2 SW3.2
$2N3396: R84.1 SW3.1
$2N3655: LED3.2(A) R86.2
$2N6611: LED2.2(A) R81.2
$2N6716: LED3.1(C) U21.1

Not connected (* = marked no-connect by the designer): CN3 5* 6*; CN17 5* 6*; CN18 5* 6*; CN21 5* 6*; CN22 3* 4*; CN23 3* 4*; FPC3 25* 26*; SCREW1 1; SCREW2 1; SCREW3 1; SCREW4 1; SW1 3*; U3 1(EN)*; U4 7(ITIMER)*; U16 25(ENABLE)*; U18 4*; U19 25(ENABLE)*; U21 4*

## Notes on the sheets
sheet 1
- NRETRY到地->无限次重试
- RETRY_DLY 2.2NF到地->100ms重试间隔
- 105R电阻->14A限流
- VCC->8V4降压
- 最大电流14A->1k电阻
- -->控制mos管实现反向截止
- 过压过流检测
  电源输入->电子保险丝->FUSED_VCC
- 电源部分
- CAN总线
- 驱动板控制线
- 总线舵机
- I2C接口
sheet 2
- VREF调节输出电流
  1.25A适配42电机；2.1A适配57电机
- 调节步进微分数
- 其他配置：decay00->智能调优动态衰减
  TOFF0->7us关断时间
- 控制nSLEEP引脚->高电平有效
